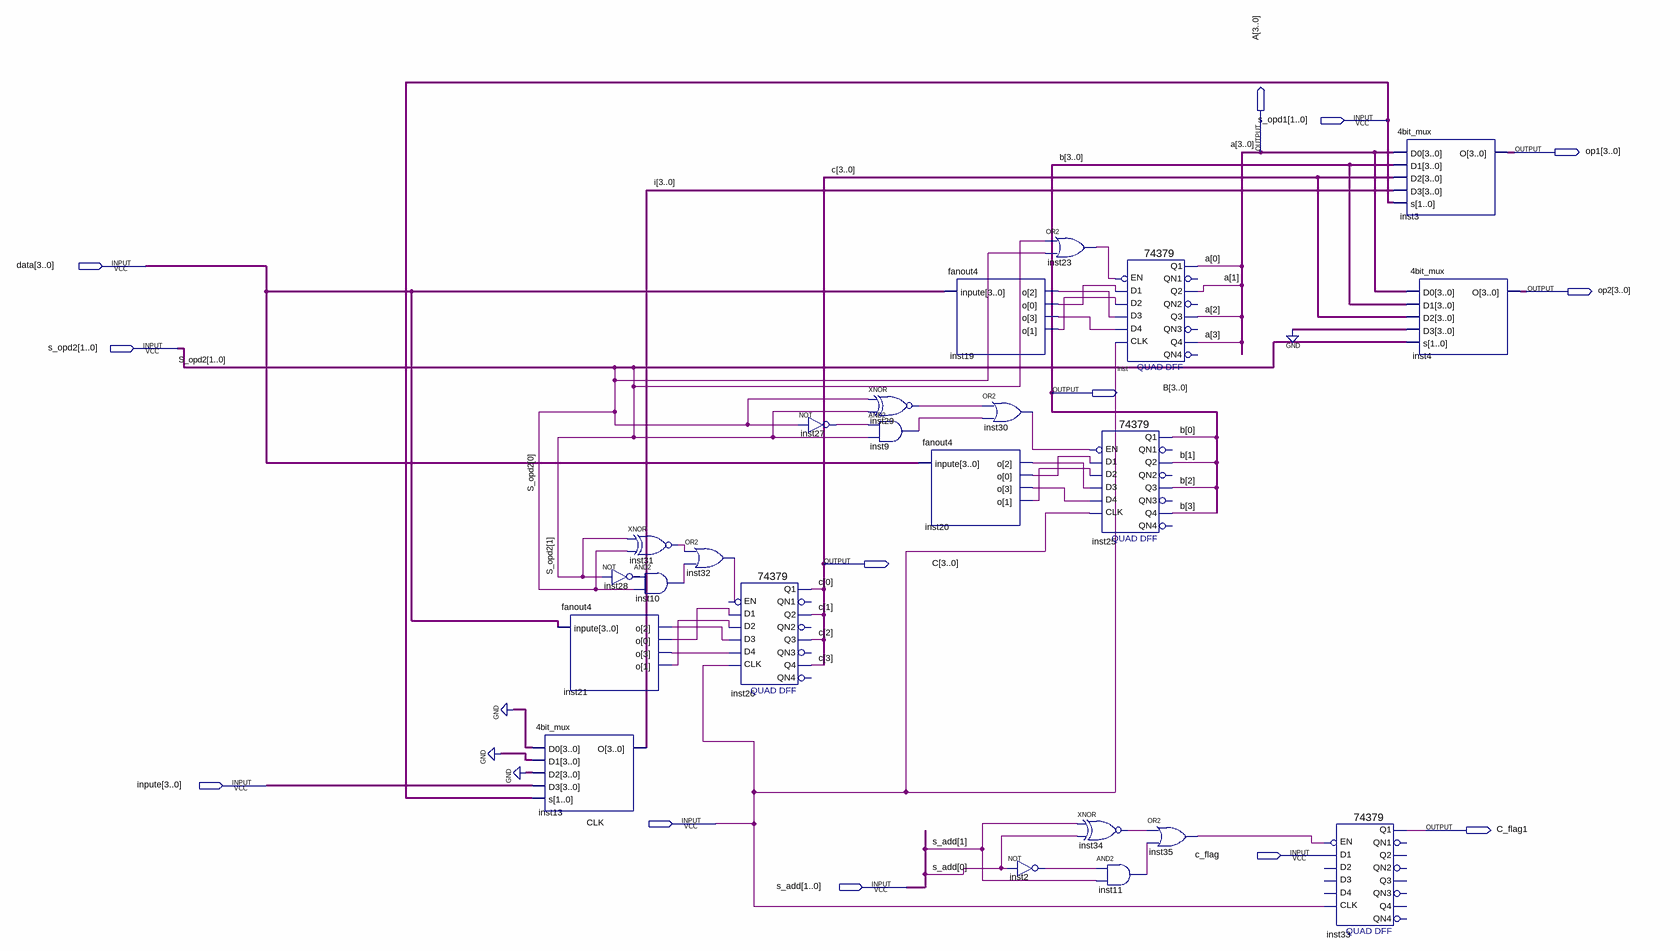
[diagram p0: schematic sheet]
// Quartus schematic regfile.bdf as structural Verilog: 23 symbols, 13 pins
module regfile (
  input  [1:0] s_opd1,
  input  [3:0] data,
  input  [1:0] s_opd2,
  input  [3:0] inpute,
  input  CLK,
  input  c_flag,
  input  [1:0] s_add,
  output [3:0] A,
  output [3:0] op1,
  output [3:0] op2,
  output [3:0] B,
  output [3:0] C,
  output C_flag1
);

  wire inst2_out, inst9_out, inst10_out, inst11_out, inst19_o, inst19_o_2, inst19_o_3, inst19_o_4, inst20_o,
       inst20_o_2, inst20_o_3, inst20_o_4, inst21_o, inst21_o_2, inst21_o_3, inst21_o_4, inst23_out,
       inst27_out, inst28_out, inst29_out, inst30_out, inst31_out, inst32_out, inst34_out, inst35_out;
  wire [3:0] i;

  fanout4 inst21 (.inpute(data), .o({inst21_o_4, inst21_o_3, inst21_o, inst21_o_2}));
  \4bit_mux  inst13 (.D0(4'b0000), .D1(4'b0000), .D2(4'b0000), .D3(inpute), .s(s_opd1), .O(i));
  not inst28 (inst28_out, s_opd2[1]);
  xnor inst31 (inst31_out, s_opd2[1], s_opd2[0]);
  and inst10 (inst10_out, inst28_out, s_opd2[0]);
  or inst32 (inst32_out, inst31_out, inst10_out);
  \74379  inst26 (
    .D1(inst21_o_2), .EN(inst32_out), .D2(inst21_o), .D3(inst21_o_3), .CLK(CLK), .D4(inst21_o_4), .Q4(C[3]),
    .Q3(C[2]), .Q2(C[1]), .Q1(C[0]));  // open: QN4, QN2, QN3, QN1
  not inst27 (inst27_out, s_opd2[0]);
  xnor inst29 (inst29_out, s_opd2[0], s_opd2[1]);
  and inst9 (inst9_out, inst27_out, s_opd2[1]);
  fanout4 inst20 (.inpute(data), .o({inst20_o_4, inst20_o_3, inst20_o_2, inst20_o}));
  fanout4 inst19 (.inpute(data), .o({inst19_o_4, inst19_o_3, inst19_o_2, inst19_o}));
  or inst30 (inst30_out, inst29_out, inst9_out);
  not inst2 (inst2_out, s_add[0]);
  or inst23 (inst23_out, s_opd2[1], s_opd2[0]);
  \74379  inst (
    .D1(inst19_o), .EN(inst23_out), .D2(inst19_o_2), .D3(inst19_o_3), .CLK(CLK), .D4(inst19_o_4), .Q4(A[3]),
    .Q3(A[2]), .Q2(A[1]), .Q1(A[0]));  // open: QN4, QN2, QN3, QN1
  \74379  inst25 (
    .D1(inst20_o), .EN(inst30_out), .D2(inst20_o_2), .D3(inst20_o_3), .CLK(CLK), .D4(inst20_o_4), .Q4(B[3]),
    .Q3(B[2]), .Q2(B[1]), .Q1(B[0]));  // open: QN4, QN2, QN3, QN1
  xnor inst34 (inst34_out, s_add[1], s_add[0]);
  and inst11 (inst11_out, inst2_out, s_add[1]);
  or inst35 (inst35_out, inst34_out, inst11_out);
  \74379  inst33 (
    .D1(c_flag), .EN(inst35_out), .CLK(CLK), .Q1(C_flag1));  // open: D2, D3, D4, QN4, Q4, QN2, Q3, QN3, QN1, Q2
  \4bit_mux  inst3 (.D0(A), .D1(B), .D2(C), .D3(i), .s(s_opd1), .O(op1));
  \4bit_mux  inst4 (.D0(A), .D1(B), .D2(C), .D3(4'b0000), .s(s_opd2), .O(op2));
endmodule
